# EasyEDA schematic Shield_V4_Connector.json
TITLE: Connector for Shield V4; REV: 1.0; Date: 2023-07-23; Sheet: 1/1; Company: Amir BS
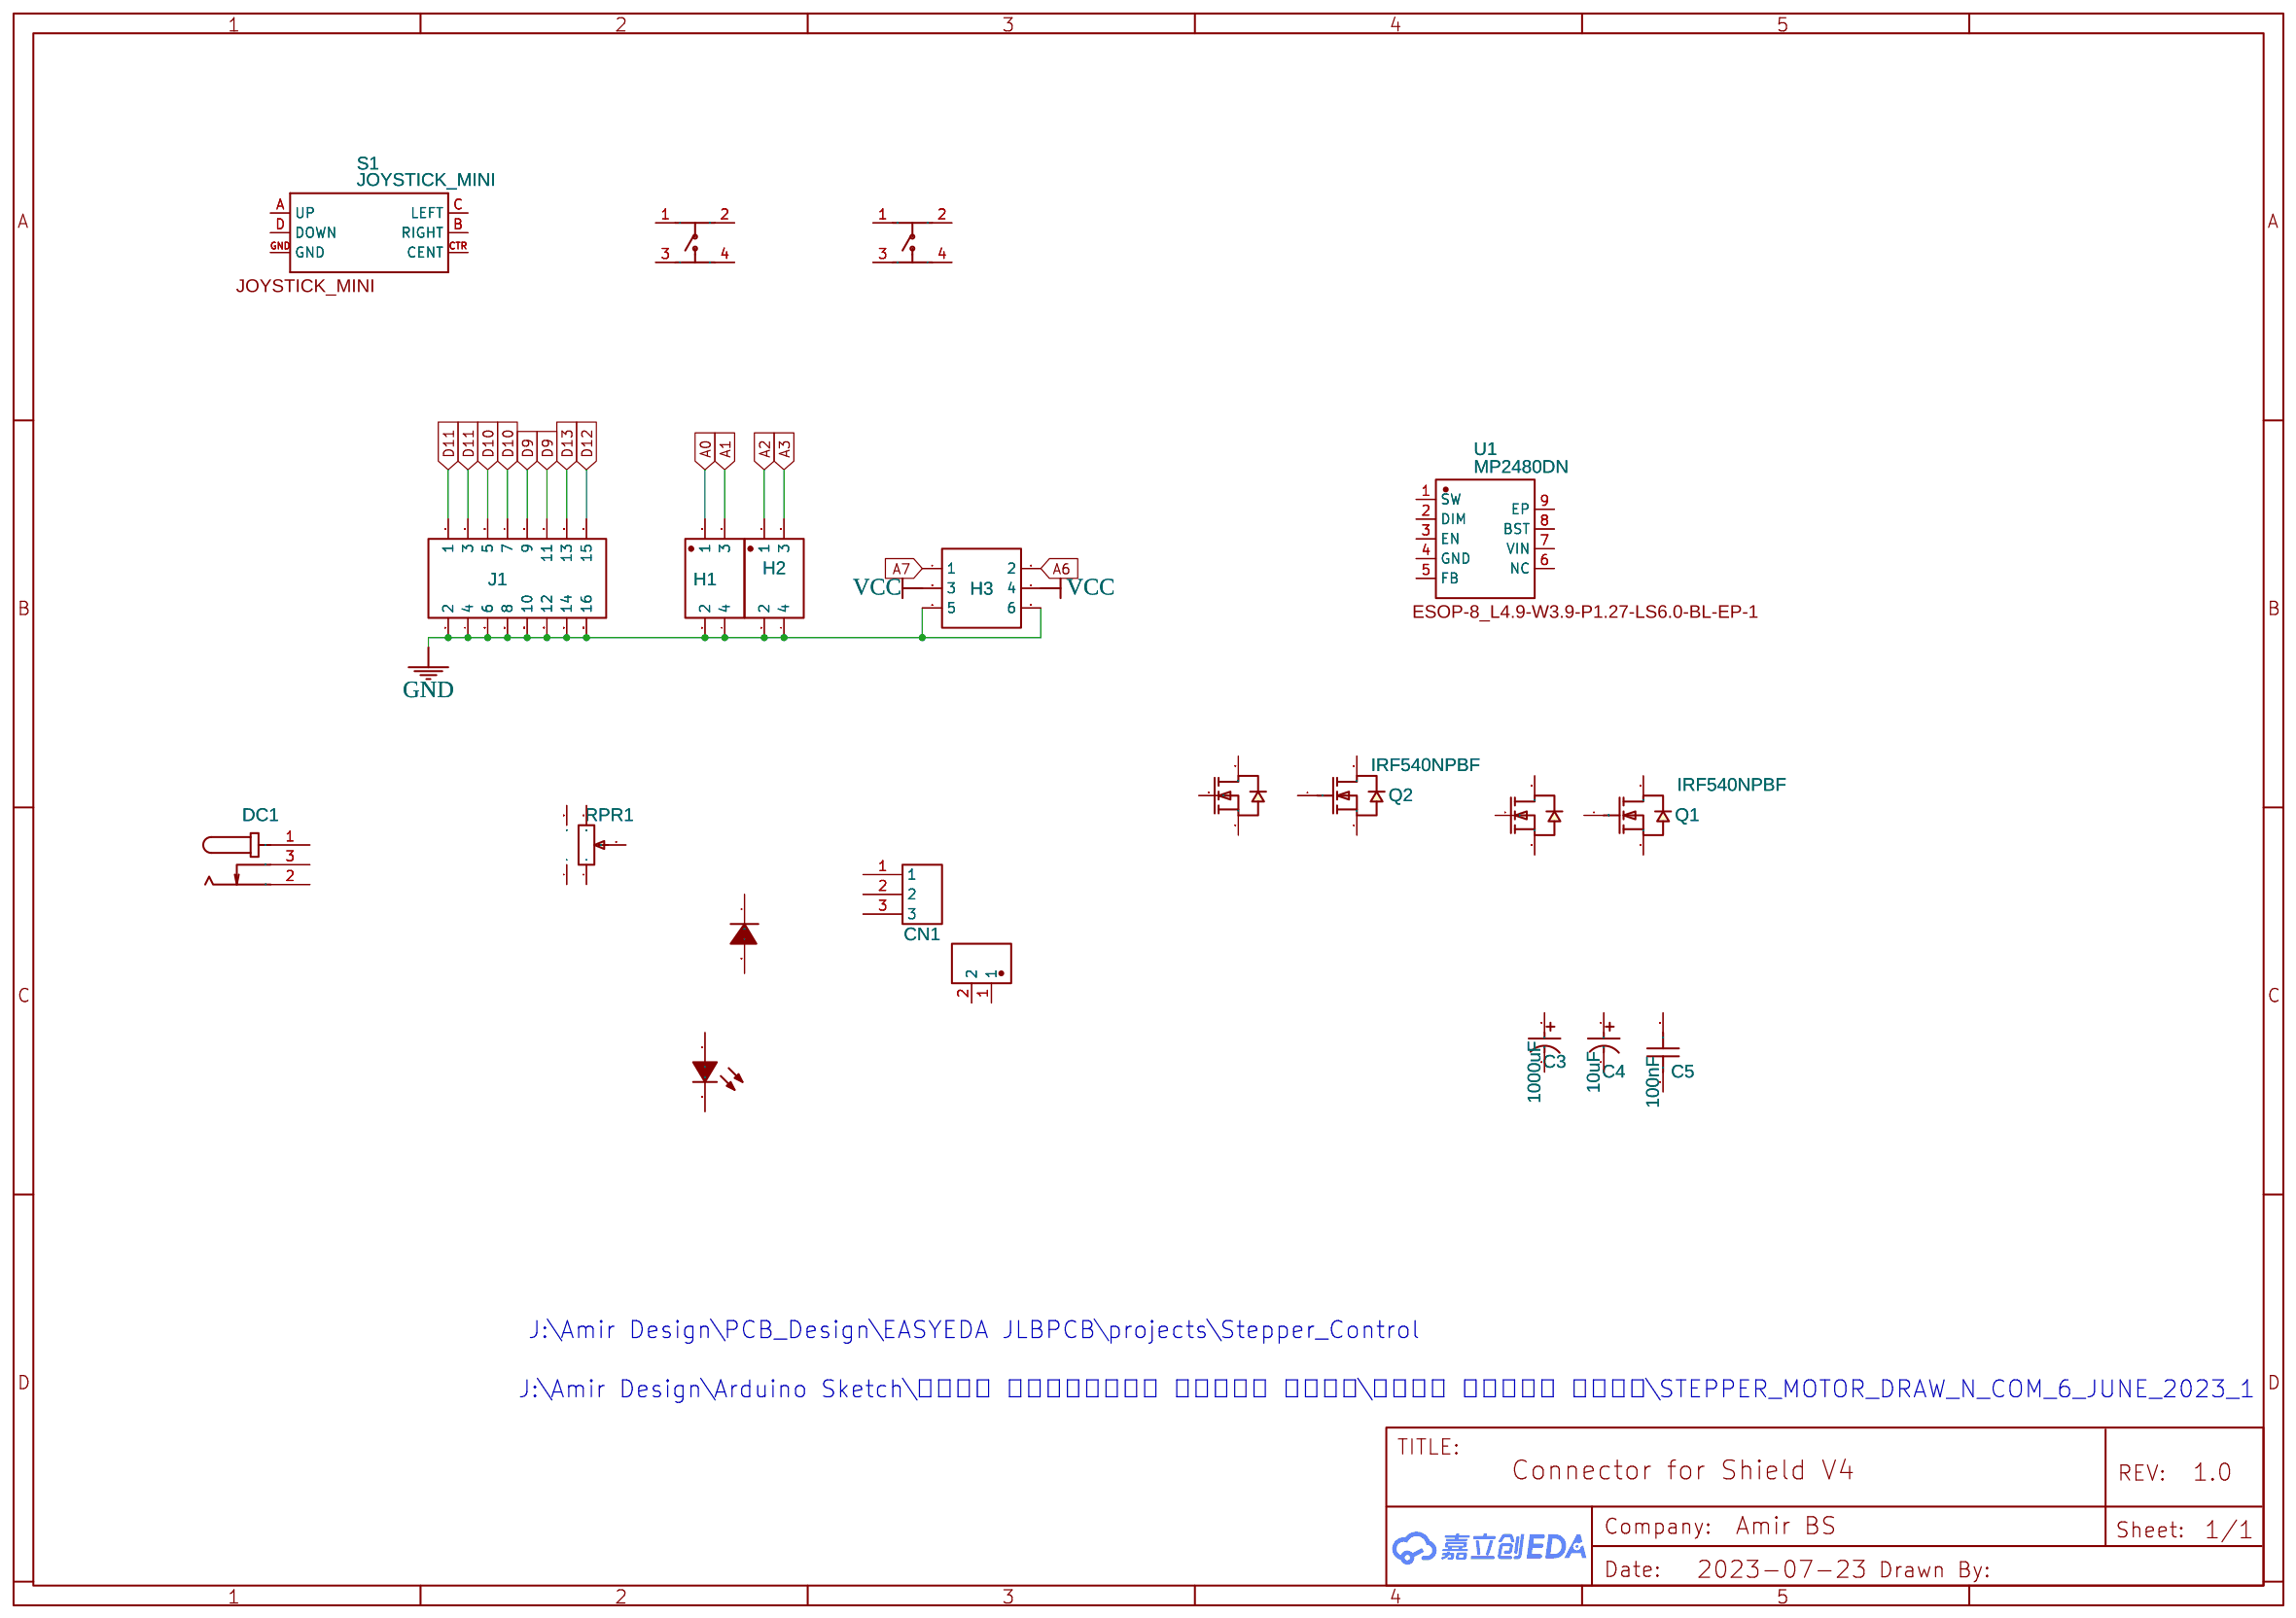
[diagram p0: schematic sheet]

## Parts
ACON1  CON  [CONN-TH_PH-2AW]
C3  1000uF  [CAP-TH_BD10.0-P5.00-D1.0-FD]
C4  10uF  [CAP-TH_BD4.0-P1.50-D0.8-FD]
C5  100nF  [C0603]
CN1  XHB-3A  [CONN-TH_XHB-3A]
DC1  DC  [DC-IN-TH_DC005]
H1  Header-Female-2.54_2x2  [HDR-TH_4P-P2.54-V-F-R2-C2-S2.54]
H2  Header-Female-2.54_2x2  [HDR-TH_4P-P2.54-V-F-R2-C2-S2.54]
H3  Header-Female-2.54_2x3  [HDR-TH_6P-P2.54-V-F-R2-C3-S2.54]
HQ1  Q  [SOT-23-3_L2.9-W1.3-P1.90-LS2.4-BR]
HQ2  Q  [SOT-23-3_L2.9-W1.3-P1.90-LS2.4-BR]
ID1  D  [SMAF_L3.5-W2.6-LS4.7-RD]
ILED1  LED  [LED0603-R-RD_BLUE]
J1  Header-Female-2.54_2x8  [HDR-TH_16P-P2.54-V-F-R2-C8-S2.54-1]
KEY1  B3F-4050  [KEY-TH_4P-L12.0-W12.0-P5.00-LS13.4-EH]
KEY2  B3F-4050  [KEY-TH_4P-L12.0-W12.0-P5.00-LS13.4-EH]
Q1  IRF540NPBF  [TO-220-3_L10.0-W4.5-P2.54-L]
Q2  IRF540NPBF  [TO-220-3_L10.0-W4.5-P2.54-L]
RPR1  长柄旋转电位器  [RES-ADJ-TH_RV09]
S1  JOYSTICK_MINI  [JOYSTICK_MINI]
U1  MP2480DN  [ESOP-8_L4.9-W3.9-P1.27-LS6.0-BL-EP-1]

## Library data of the parts
ACON1 = PH-2AW: Supplier: LCSC; Supplier Part: C722769; Manufacturer: CAX(创都); Contributor: LCSC; JLCPCB Part Class: Extended Part; Package Display: No
C3 = KF102M025G200A: Supplier: LCSC; Manufacturer: CapXon(丰宾); Supplier Part: C59326; JLCPCB Part Class: Extended Part; Package Display: No
C4 = 10uF 25V 4*5: Supplier: LCSC; Manufacturer: CX(承兴); Manufacturer Part: KF106M025C05RR0VH2FP0; Supplier Part: C43846; JLCPCB Part Class: Extended Part; Package Display: No
C5 = CC0603KRX7R9BB104: Supplier: LCSC; Manufacturer: YAGEO(国巨); Supplier Part: C14663; JLCPCB Part Class: Basic Part; Package Display: No
CN1 = XHB-3A: Supplier: LCSC; Manufacturer: BOOMELE; Supplier Part: C68817; JLCPCB Part Class: Extended Part; Package Display: No
DC1 = DC005-2.0MM: Supplier: LCSC; Manufacturer: SOFNG; Supplier Part: C111567; Package Display: No
H1 H2 = Header-Female-2.54_2x2: Supplier: LCSC; Manufacturer: CONNFLY; Manufacturer Part: DS1023-2*2SF11; Contributor: LCSC; Supplier Part: C92273; JLCPCB Part Class: Extended Part; Package Display: No
H3 = Header-Female-2.54_2x3: Supplier: LCSC; Manufacturer: CONNFLY; Manufacturer Part: DS1023-2*3SF11; Contributor: LCSC; Supplier Part: C92272; JLCPCB Part Class: Extended Part; Package Display: No
HQ1 HQ2 = JSM2302: Supplier: LCSC; Supplier Part: C916403; Manufacturer: JSMSEMI; Contributor: LCSC; JLCPCB Part Class: Extended Part; Package Display: No
ID1 = 1N4007F: Supplier: LCSC; Manufacturer: SK; Supplier Part: C110856; JLCPCB Part Class: Extended Part; Package Display: No
ILED1 = 19-217/BHC-ZL1M2RY/3T: Supplier: LCSC; Manufacturer: EVERLIGHT; Supplier Part: C72041; JLCPCB Part Class: Basic Part; Package Display: No
J1 = Header-Female-2.54_2x8: Supplier: LCSC; Manufacturer: BOOMELE(博穆精密); Manufacturer Part: 2.54-2*8P母; Supplier Part: C30734; JLCPCB Part Class: Extended Part; Package Display: No
KEY1 KEY2 = B3F-4050: Supplier: LCSC; Manufacturer: OMRON; Supplier Part: C86707; JLCPCB Part Class: Extended Part; Package Display: No
Q1 Q2 = IRF540NPBF: Supplier: LCSC; Manufacturer: Infineon(英飞凌); Supplier Part: C2566; JLCPCB Part Class: Extended Part; Package Display: No
RPR1 = 长柄旋转电位器: Supplier: LCSC; Supplier Part: C2874842; Manufacturer: null; JLCPCB Part Class: Extended Part; Contributor: LCSC; Package Display: No
S1 = JOYSTICK_MINI: Small 5-way tactile joystick, COM-10063; Contributor: SparkFun; Package Display: Yes
U1 = MP2480DN: Contributor: LCSC; Supplier: LCSC; Supplier Part: C9900004142; Manufacturer: null; JLCPCB Part Class: Extended Part; Package Display: Yes

## Nets
GND: H1.2 H1.4 H2.2 H2.4 H3.5 H3.6 J1.2 J1.4 J1.6 J1.8 J1.10 J1.12 J1.14 J1.16
VCC: H3.3 H3.4
A0: H1.1
A1: H1.3
A2: H2.1
A3: H2.3
A6: H3.2
A7: H3.1
D9: J1.9 J1.11
D10: J1.5 J1.7
D11: J1.1 J1.3
D12: J1.15
D13: J1.13

Not connected (* = marked no-connect by the designer): ACON1 1 2; C3 1 2; C4 1 2; C5 1 2; CN1 1 2 3; DC1 1 2 3; HQ1 1(G) 2(S) 3(D); HQ2 1(G) 2(S) 3(D); ID1 1(C) 2(A); ILED1 1(A) 2(C); KEY1 1 2 3 4; KEY2 1 2 3 4; Q1 1(G) 2(D) 3(S); Q2 1(G) 2(D) 3(S); RPR1 1 2 3 4 5; S1 A(UP) B(RIGHT) C(LEFT) CTR(CENT) D(DOWN) GND; U1 1(SW) 2(DIM) 3(EN) 4(GND) 5(FB) 6(NC) 7(VIN) 8(BST) 9(EP)

## Notes on the sheet
- J:\Amir Design\PCB_Design\EASYEDA JLBPCB\projects\Stepper_Control
- J:\Amir Design\Arduino Sketch\קודי ארדווינו למנוע סטפר\בודק מנועי סטפר\STEPPER_MOTOR_DRAW_N_COM_6_JUNE_2023_1
